# Altium project MachChinh.PrjPCB
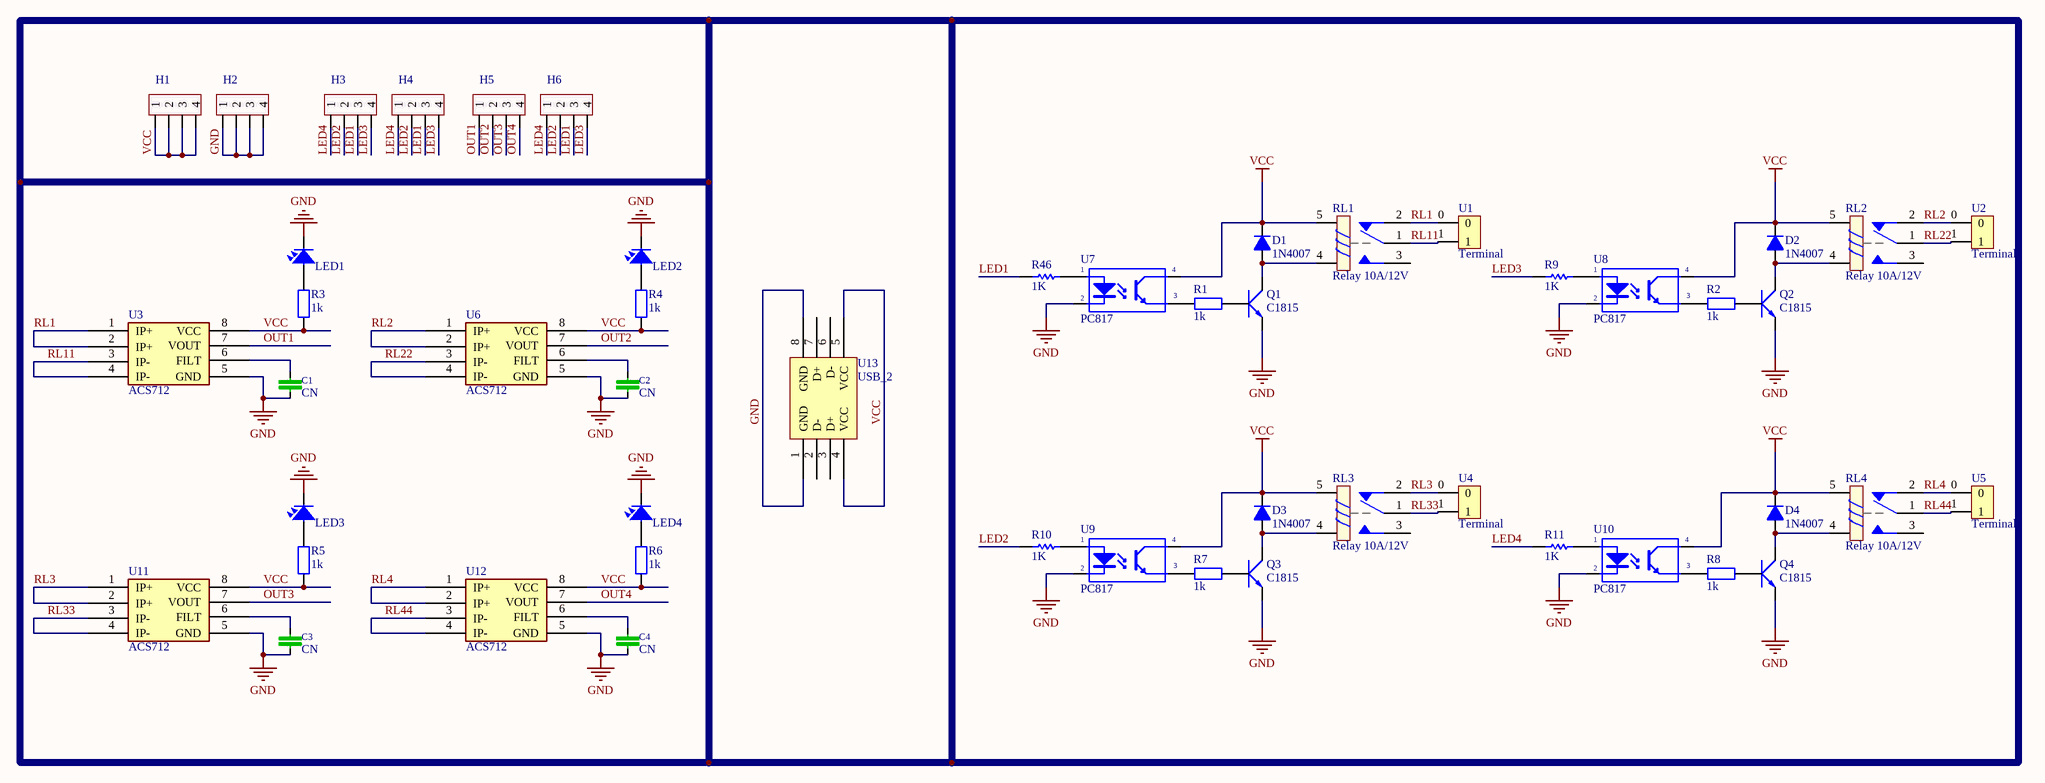
[diagram p0: MachChinh.SchDoc]
1 sheet, 51 parts. Net scope: global (net labels, ports and power ports of the same name join across sheets).
Board file: MachChinh.PcbDoc

## Sheet MachChinh.SchDoc
size A3

### Parts
C1  CN  [C020-020,040]
C2  CN  [C020-020,040]
C3  CN  [C020-020,040]
C4  CN  [C020-020,040]
D1  1N4007  [D1A]
D2  1N4007  [D1A]
D3  1N4007  [D1A]
D4  1N4007  [D1A]
H1  Header4  [Header4]  (value not drawn)
H2  Header4  [Header4]  (value not drawn)
H3  Header4  [Header4]  (value not drawn)
H4  Header4  [Header4]  (value not drawn)
H5  Header4  [Header4]  (value not drawn)
H6  Header4  [Header4]  (value not drawn)
LED1  LED  [LED-3]  (value not drawn)
LED2  LED  [LED-3]  (value not drawn)
LED3  LED  [LED-3]  (value not drawn)
LED4  LED  [LED-3]  (value not drawn)
Q1  C1815  [QTO-92]
Q2  C1815  [QTO-92]
Q3  C1815  [QTO-92]
Q4  C1815  [QTO-92]
R1  1k  [R1/4W]
R2  1k  [R1/4W]
R3  1k  [R1/4W]
R4  1k  [R1/4W]
R5  1k  [R1/4W]
R6  1k  [R1/4W]
R7  1k  [R1/4W]
R8  1k  [R1/4W]
R9  value 1K  [R1/4W]  (hidden comment: Res1)
R10  value 1K  [R1/4W]  (hidden comment: Res1)
R11  value 1K  [R1/4W]  (hidden comment: Res1)
R46  value 1K  [R1/4W]  (hidden comment: Res1)
RL1  Relay 10A/12V  [RL_SPDT_10A]
RL2  Relay 10A/12V  [RL_SPDT_10A]
RL3  Relay 10A/12V  [RL_SPDT_10A]
RL4  Relay 10A/12V  [RL_SPDT_10A]
U1  Terminal  [TERMINAL5.08]
U2  Terminal  [TERMINAL5.08]
U3  ACS712  [ACS712]
U4  Terminal  [TERMINAL5.08]
U5  Terminal  [TERMINAL5.08]
U6  ACS712  [ACS712]
U7  PC817  [DIP4/W0.3]
U8  PC817  [DIP4/W0.3]
U9  PC817  [DIP4/W0.3]
U10  PC817  [DIP4/W0.3]
U11  ACS712  [ACS712]
U12  ACS712  [ACS712]
U13  USB_2  [USB_2]

### Nets
GND: C1.2 C2.2 C3.2 C4.2 H2.1 H2.2 H2.3 H2.4 LED1.2 LED2.2 LED3.2 LED4.2 Q1.1(E) Q2.1(E) Q3.1(E) Q4.1(E) U3.5(GND) U6.5(GND) U7.2(K) U8.2(K) U9.2(K) U10.2(K) U11.5(GND) U12.5(GND) U13.1(GND) U13.8(GND)
VCC: D1.2(K) D2.2(K) D3.2(K) D4.2(K) H1.1 H1.2 H1.3 H1.4 R3.1 R4.1 R5.1 R6.1 RL1.5 RL2.5 RL3.5 RL4.5 U3.8(VCC) U6.8(VCC) U7.4(C) U8.4(C) U9.4(C) U10.4(C) U11.8(VCC) U12.8(VCC) U13.4(VCC) U13.5(VCC)
LED1: H3.3 H4.3 H6.3 R46.2
LED2: H3.2 H4.2 H6.2 R10.2
LED3: H3.4 H4.4 H6.4 R9.2
LED4: H3.1 H4.1 H6.1 R11.2
OUT1: H5.1 U3.7(VOUT)
OUT2: H5.2 U6.7(VOUT)
OUT3: H5.3 U11.7(VOUT)
OUT4: H5.4 U12.7(VOUT)
RL1: RL1.2 U1.0 U3.1(IP+) U3.2(IP+)
RL2: RL2.2 U2.0 U6.1(IP+) U6.2(IP+)
RL3: RL3.2 U4.0 U11.1(IP+) U11.2(IP+)
RL4: RL4.2 U5.0 U12.1(IP+) U12.2(IP+)
RL11: RL1.1 U1.1 U3.3(IP-) U3.4(IP-)
RL22: RL2.1 U2.1 U6.3(IP-) U6.4(IP-)
RL33: RL3.1 U4.1 U11.3(IP-) U11.4(IP-)
RL44: RL4.1 U5.1 U12.3(IP-) U12.4(IP-)
NetC1_1: C1.1 U3.6(FILT)
NetC2_1: C2.1 U6.6(FILT)
NetC3_1: C3.1 U11.6(FILT)
NetC4_1: C4.1 U12.6(FILT)
NetD1_1: D1.1(A) Q1.2(C) RL1.4
NetD2_1: D2.1(A) Q2.2(C) RL2.4
NetD3_1: D3.1(A) Q3.2(C) RL3.4
NetD4_1: D4.1(A) Q4.2(C) RL4.4
NetLED1_1: LED1.1 R3.2
NetLED2_1: LED2.1 R4.2
NetLED3_1: LED3.1 R5.2
NetLED4_1: LED4.1 R6.2
NetQ1_3: Q1.3(B) R1.2
NetQ2_3: Q2.3(B) R2.2
NetQ3_3: Q3.3(B) R7.2
NetQ4_3: Q4.3(B) R8.2
NetR1_1: R1.1 U7.3(E)
NetR2_1: R2.1 U8.3(E)
NetR7_1: R7.1 U9.3(E)
NetR8_1: R8.1 U10.3(E)
NetR9_1: R9.1 U8.1(A)
NetR10_1: R10.1 U9.1(A)
NetR11_1: R11.1 U10.1(A)
NetR46_1: R46.1 U7.1(A)

Not connected (* = marked no-connect by the designer): RL1 3; RL2 3; RL3 3; RL4 3; U13 2(D-) 3(D+) 6(D-) 7(D+)

### Library data of the parts
C1-C4 = CN: CAP CER 0.047UF 25V X7R 0402
D1-D4 = D1A: Diode 1A; Value: 1N4007
H1-H6 = Header4: Header IDC, 4 x 1 Pin Vertical 2.54mm Pitch (Non-Boxed, Male)
LED1-LED4 = LED: LED Single colour Green and Red; Value: LED 3 ly Single Colour
Q1-Q4 = C1815: NPN 600mW, ECB; Value: C1815
R1-R8 = R1/4W: Resistor 1/4W; Value: R1/4W - 1K
R9-R11 R46 = Res1_4: Resistor; Manufacturer: Generic Components; Class: Passive; Published: 08/06/2000; Publisher: Altium Hobart Technology Centre; SubClass: Resistor
RL1-RL4 = Relay 1: Relay SPDT,10A - 12VDC 5 Pin; Value: Relay SPDT, 10A, 12V
U1 U2 U4 U5 = TERMINAL5.08
U7-U10 = PC817: Single Opto; Value: PC817
U13 = USB_2: USB